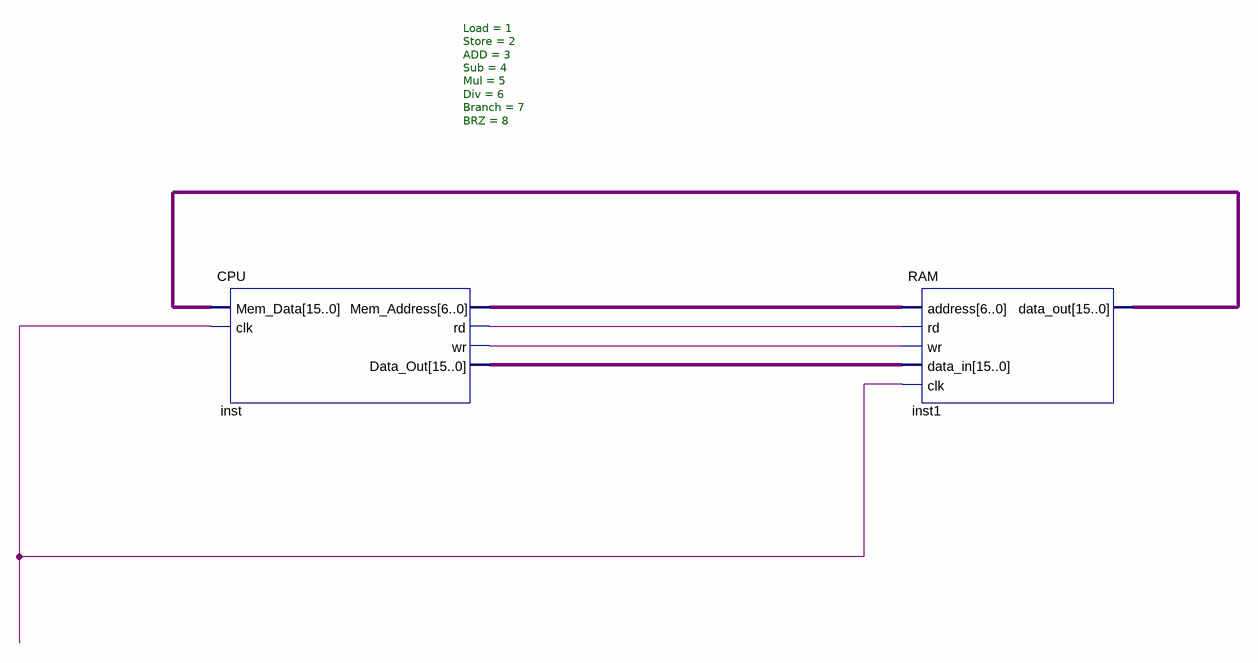
[diagram p0: schematic sheet]
// Quartus schematic accumulator_computer_test1.bdf as structural Verilog: 2 symbols, 0 pins
module accumulator_computer_test1 (
);

  wire inst_rd, inst_wr, undriven;
  wire [6:0] inst_mem_address;
  wire [15:0] inst1_data_out, inst_data_out;

  CPU #(.Load(1), .Store(2), .ADD(3), .Sub(4), .Mul(5), .Div(6), .Branch(7), .BRZ(8)) inst (
    .Mem_Data(inst1_data_out), .clk(undriven), .Mem_Address(inst_mem_address), .rd(inst_rd), .wr(inst_wr),
    .Data_Out(inst_data_out));
  RAM inst1 (
    .address(inst_mem_address), .rd(inst_rd), .wr(inst_wr), .data_in(inst_data_out), .clk(undriven),
    .data_out(inst1_data_out));
endmodule
